# Altium schematic sheet rx.SchDoc: Receiver
size Letter; CheckedBy: J. Brinton; CompanyName: Signal Laboratories, Inc.; DrawnBy: J. Brinton; Engineer: J. Brinton; Address1: 3479 Edison Way; Address2: Menlo Park CA 94025; Address3: +1 (877) 778-8435; Address4: siglabs.com; Revision: 3; SheetNumber: 11; SheetTotal: 49; ModifiedDate: 4/20/2018
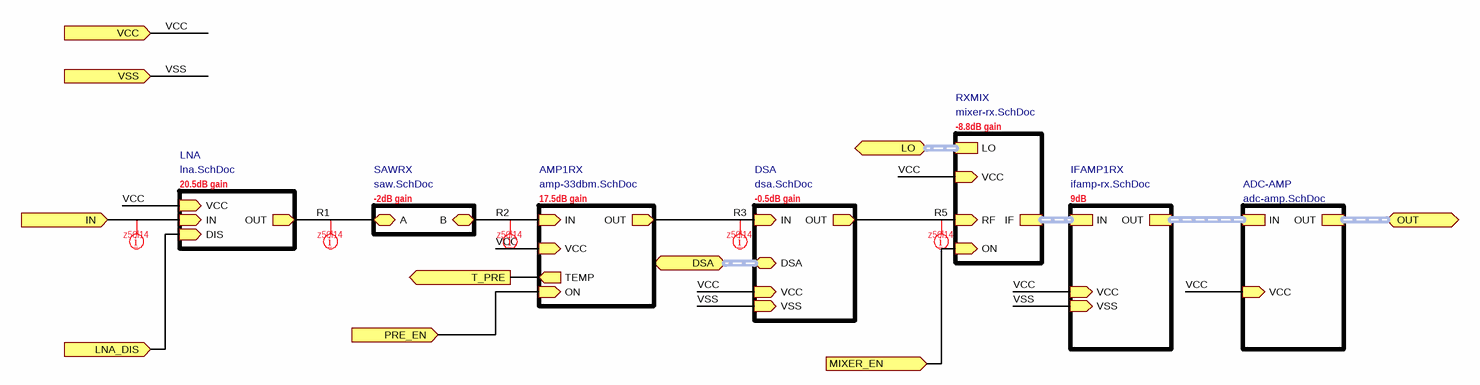
[diagram p0: rx.SchDoc]

## Sub-sheets
ADC-AMP = adc-amp.SchDoc: IN (harness DIFF100), OUT (harness DIFF100), VCC (in)
AMP1RX = amp-33dbm.SchDoc: IN (in), OUT (out), ON (in), TEMP (out), VCC (in)
DSA = dsa.SchDoc: IN (in), OUT (out), DSA (harness DSA), VSS (in), VCC (in)
IFAMP1RX = ifamp-rx.SchDoc: IN (harness DIFF100), OUT (harness DIFF100), VSS (in), VCC (in)
LNA = lna.SchDoc: IN (in), OUT (out), VCC (in), DIS (in)
RXMIX = mixer-rx.SchDoc: LO (harness CLK-LVPECL33-TERM), RF (in), IF (harness DIFF100), VCC (in), ON (in)
SAWRX = saw.SchDoc: A (bidir), B (bidir)

## Ports
DSA (harness DSA), IN (in), LNA_DIS (in), LO (harness CLK-LVPECL33-TERM), MIXER_EN (in), OUT (harness DIFF100), PRE_EN (in), T_PRE (out), VCC (in), VSS (in)

## Nets
IN: port IN, sheet LNA/IN
LNA_DIS: port LNA_DIS, sheet LNA/DIS
MIXER_EN: port MIXER_EN, sheet RXMIX/ON
PRE_EN: port PRE_EN, sheet AMP1RX/ON
R1: sheet LNA/OUT, sheet SAWRX/A
R2: sheet SAWRX/B, sheet AMP1RX/IN
R3: sheet DSA/IN, sheet AMP1RX/OUT
R5: sheet DSA/OUT, sheet RXMIX/RF
T_PRE: port T_PRE, sheet AMP1RX/TEMP
VCC: port VCC, sheet LNA/VCC, sheet DSA/VCC, sheet RXMIX/VCC, sheet IFAMP1RX/VCC, sheet AMP1RX/VCC, sheet ADC-AMP/VCC
VSS: port VSS, sheet DSA/VSS, sheet IFAMP1RX/VSS

## Buses and harness runs
harness port DSA = sheet DSA/DSA
harness port LO = sheet RXMIX/LO
harness port OUT = sheet ADC-AMP/OUT
harness sheet ADC-AMP/IN = sheet IFAMP1RX/OUT
harness sheet IFAMP1RX/IN = sheet RXMIX/IF

## Layout directives
net class z50l14: IN, R1, R2, R3, R5

## Notes on the sheet
- -8.8dB gain
- 20.5dB gain
- -2dB gain
- 17.5dB gain
- -0.5dB gain
- 9dB
- Title
- Engineer
- Revision
- Drawn By
- Checked By
- Date
- Sheet
- of